# Altium project FMC_DIO_32ch_lvds_a.PrjPcb (part 1 of 2)
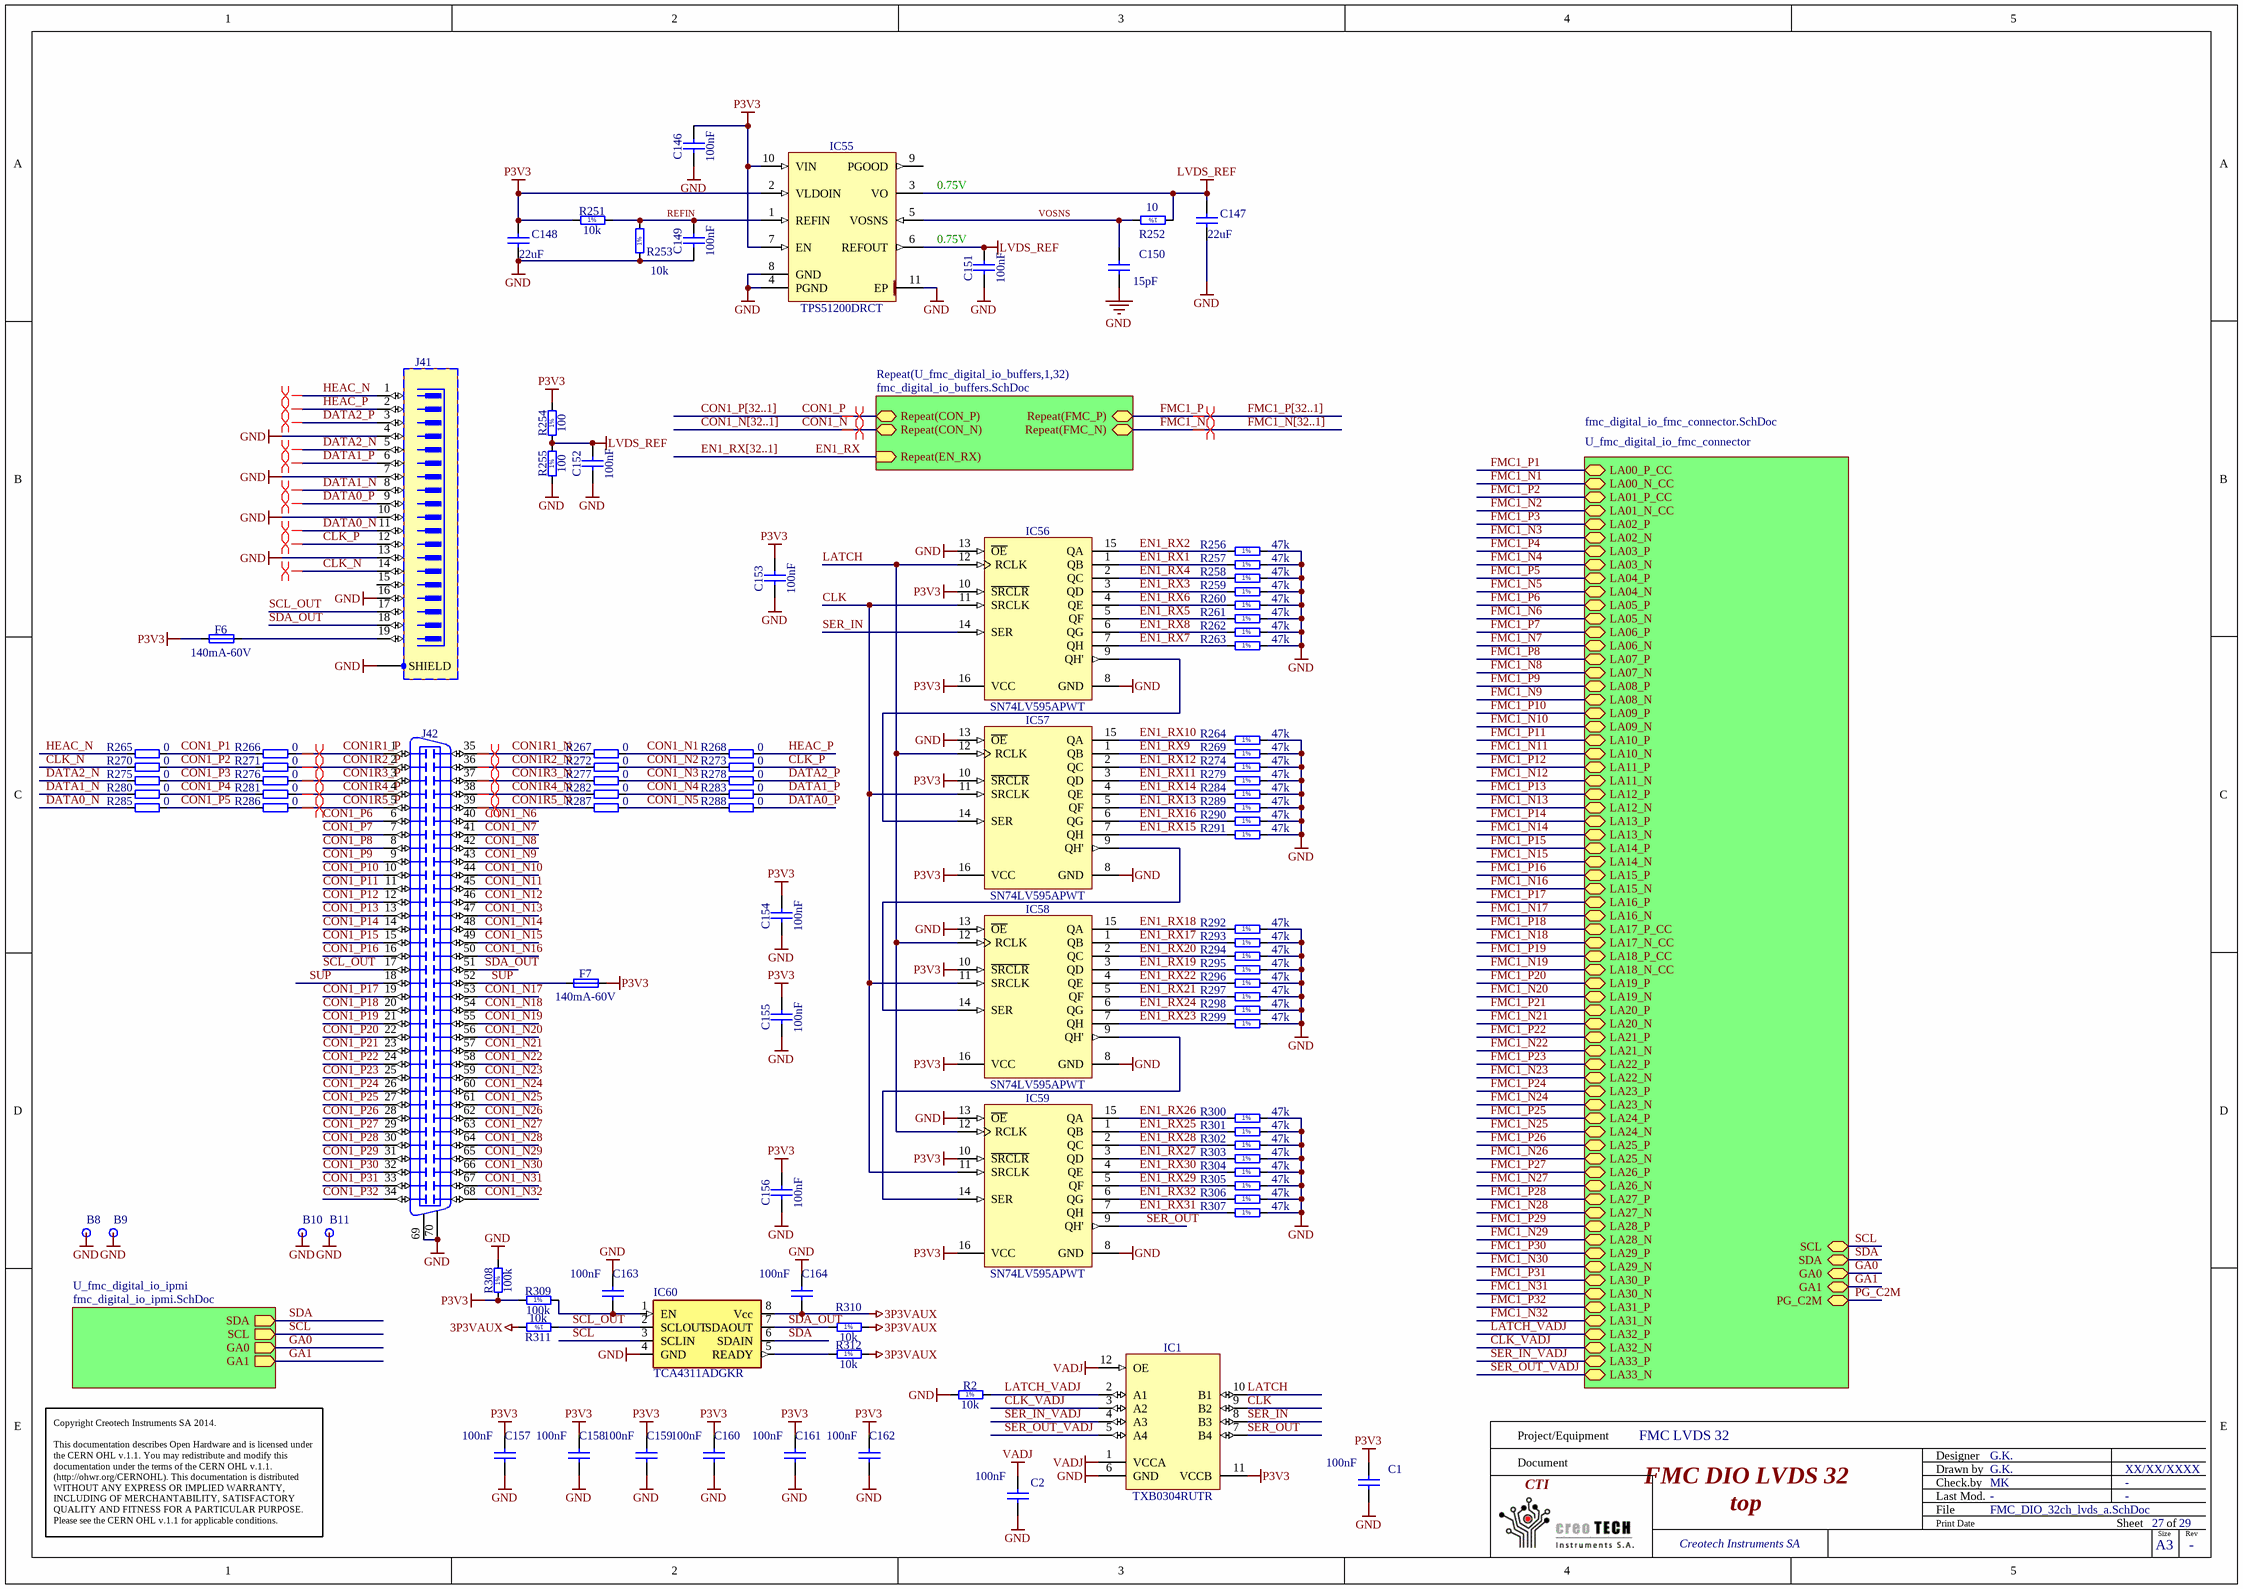
[diagram p0: FMC_DIO_32ch_lvds_a.SchDoc]
4 sheets, 558 parts. Net scope: hierarchical (ports join the sheet entries above them; power ports are global).
Board file: FMC_DIO_32ch_lvds_a.PcbDoc
Sheets:
  FMC_DIO_32ch_lvds_a.SchDoc
    U_fmc_digital_io_ipmi = fmc_digital_io_ipmi.SchDoc
    U_fmc_digital_io_fmc_connector = fmc_digital_io_fmc_connector.SchDoc
    U_fmc_digital_io_buffers1 = fmc_digital_io_buffers.SchDoc
    U_fmc_digital_io_buffers2 = fmc_digital_io_buffers.SchDoc
    U_fmc_digital_io_buffers3 = fmc_digital_io_buffers.SchDoc
    U_fmc_digital_io_buffers4 = fmc_digital_io_buffers.SchDoc
    U_fmc_digital_io_buffers5 = fmc_digital_io_buffers.SchDoc
    U_fmc_digital_io_buffers6 = fmc_digital_io_buffers.SchDoc
    U_fmc_digital_io_buffers7 = fmc_digital_io_buffers.SchDoc
    U_fmc_digital_io_buffers8 = fmc_digital_io_buffers.SchDoc
    U_fmc_digital_io_buffers9 = fmc_digital_io_buffers.SchDoc
    U_fmc_digital_io_buffers10 = fmc_digital_io_buffers.SchDoc
    U_fmc_digital_io_buffers11 = fmc_digital_io_buffers.SchDoc
    U_fmc_digital_io_buffers12 = fmc_digital_io_buffers.SchDoc
    U_fmc_digital_io_buffers13 = fmc_digital_io_buffers.SchDoc
    U_fmc_digital_io_buffers14 = fmc_digital_io_buffers.SchDoc
    U_fmc_digital_io_buffers15 = fmc_digital_io_buffers.SchDoc
    U_fmc_digital_io_buffers16 = fmc_digital_io_buffers.SchDoc
    U_fmc_digital_io_buffers17 = fmc_digital_io_buffers.SchDoc
    U_fmc_digital_io_buffers18 = fmc_digital_io_buffers.SchDoc
    U_fmc_digital_io_buffers19 = fmc_digital_io_buffers.SchDoc
    U_fmc_digital_io_buffers20 = fmc_digital_io_buffers.SchDoc
    U_fmc_digital_io_buffers21 = fmc_digital_io_buffers.SchDoc
    U_fmc_digital_io_buffers22 = fmc_digital_io_buffers.SchDoc
    U_fmc_digital_io_buffers23 = fmc_digital_io_buffers.SchDoc
    U_fmc_digital_io_buffers24 = fmc_digital_io_buffers.SchDoc
    U_fmc_digital_io_buffers25 = fmc_digital_io_buffers.SchDoc
    U_fmc_digital_io_buffers26 = fmc_digital_io_buffers.SchDoc
    U_fmc_digital_io_buffers27 = fmc_digital_io_buffers.SchDoc
    U_fmc_digital_io_buffers28 = fmc_digital_io_buffers.SchDoc
    U_fmc_digital_io_buffers29 = fmc_digital_io_buffers.SchDoc
    U_fmc_digital_io_buffers30 = fmc_digital_io_buffers.SchDoc
    U_fmc_digital_io_buffers31 = fmc_digital_io_buffers.SchDoc
    U_fmc_digital_io_buffers32 = fmc_digital_io_buffers.SchDoc

## Sheet FMC_DIO_32ch_lvds_a.SchDoc: FMC DIO LVDS 32
size 420 x 297 mm; Projet: FMC LVDS 32; CheckedBy: MK; Author: G.K.; CompanyName: CREOTECH; DrawnBy: G.K.; Organization: CTI SA; Address1: Creotech Instruments SA; Address2: Okulickiego 7/9, 05-500 Poland; DocumentNumber: 27; Revision: -; SheetNumber: 27; SheetTotal: 29; ModifiedBy: -; CreateDate: XX/XX/XXXX; CheckedDate: -; Title2: top; DivGrp: CTI; Designer: G.K.; ModifiedDate: -; ProjectName: FMC LVDS 32

### Parts
B8  Plated Hole  [MTG300_600]  (value not drawn)
B9  Plated Hole  [MTG300_600]  (value not drawn)
B10  Plated Hole  [MTG300_600]  (value not drawn)
B11  Plated Hole  [MTG300_600]  (value not drawn)
C1  100nF  [CAPC1005X55N]
C2  100nF  [CAPC1005X55N]
C146  100nF  [CAPC1005X55N]
C147  22uF  [CAPC3216X180N]
C148  22uF  [CAPC3216X180N]
C149  100nF  [CAPC1005X55N]
C150  15pF  [CAPC1005X55N]
C151  100nF  [CAPC1005X55N]
C152  100nF  [CAPC1005X55N]
C153  100nF  [CAPC1005X55N]
C154  100nF  [CAPC1005X55N]
C155  100nF  [CAPC1005X55N]
C156  100nF  [CAPC1005X55N]
C157  100nF  [CAPC1005X55N]
C158  100nF  [CAPC1005X55N]
C159  100nF  [CAPC1005X55N]
C160  100nF  [CAPC1005X55N]
C161  100nF  [CAPC1005X55N]
C162  100nF  [CAPC1005X55N]
C163  100nF  [CAPC1005X55N]
C164  100nF  [CAPC1005X55N]
F6  140mA-60V  [FUSRC4632X90N]
F7  140mA-60V  [FUSRC4632X90N]
IC1  TXB0304RUTR  [TEXAS_RUT (R-PUQFN-N12)]
IC55  TPS51200DRCT  [TEXAS_DRC (S-PVSON-N10)]
IC56  SN74LV595APWT  [SOP65P640X120-16N]
IC57  SN74LV595APWT  [SOP65P640X120-16N]
IC58  SN74LV595APWT  [SOP65P640X120-16N]
IC59  SN74LV595APWT  [SOP65P640X120-16N]
IC60  TCA4311ADGKR  [msop-8]
J41  HDMI  [MOLEX_46765-1001]  (value not drawn)
J42  DNP  [MOLEX_71430-0013]  (value not drawn)
R2  10k  [RESC1005X40N]
R251  10k  [RESC1005X40N]
R252  10  [RESC1005X40N]
R253  10k  [RESC1005X40N]
R254  100  [RESC1005X40N]
R255  100  [RESC1005X40N]
R256  47k  [RESC1005X40N]
R257  47k  [RESC1005X40N]
R258  47k  [RESC1005X40N]
R259  47k  [RESC1005X40N]
R260  47k  [RESC1005X40N]
R261  47k  [RESC1005X40N]
R262  47k  [RESC1005X40N]
R263  47k  [RESC1005X40N]
R264  47k  [RESC1005X40N]
R265  0  [RESC1005X40N]
R266  0  [RESC1005X40N]
R267  0  [RESC1005X40N]
R268  0  [RESC1005X40N]
R269  47k  [RESC1005X40N]
R270  0  [RESC1005X40N]
R271  0  [RESC1005X40N]
R272  0  [RESC1005X40N]
R273  0  [RESC1005X40N]
R274  47k  [RESC1005X40N]
R275  0  [RESC1005X40N]
R276  0  [RESC1005X40N]
R277  0  [RESC1005X40N]
R278  0  [RESC1005X40N]
R279  47k  [RESC1005X40N]
R280  0  [RESC1005X40N]
R281  0  [RESC1005X40N]
R282  0  [RESC1005X40N]
R283  0  [RESC1005X40N]
R284  47k  [RESC1005X40N]
R285  0  [RESC1005X40N]
R286  0  [RESC1005X40N]
R287  0  [RESC1005X40N]
R288  0  [RESC1005X40N]
R289  47k  [RESC1005X40N]
R290  47k  [RESC1005X40N]
R291  47k  [RESC1005X40N]
R292  47k  [RESC1005X40N]
R293  47k  [RESC1005X40N]
R294  47k  [RESC1005X40N]
R295  47k  [RESC1005X40N]
R296  47k  [RESC1005X40N]
R297  47k  [RESC1005X40N]
R298  47k  [RESC1005X40N]
R299  47k  [RESC1005X40N]
R300  47k  [RESC1005X40N]
R301  47k  [RESC1005X40N]
R302  47k  [RESC1005X40N]
R303  47k  [RESC1005X40N]
R304  47k  [RESC1005X40N]
R305  47k  [RESC1005X40N]
R306  47k  [RESC1005X40N]
R307  47k  [RESC1005X40N]
R308  100k  [RESC1005X40N]
R309  100k  [RESC1005X40N]
R310  10k  [RESC1005X40N]
R311  10k  [RESC1005X40N]
R312  10k  [RESC1005X40N]

### Sub-sheets
Repeat(U_fmc_digital_io_buffers,1,32) = fmc_digital_io_buffers.SchDoc: Repeat(EN_RX) (in), Repeat(CON_P) (bidir), Repeat(CON_N) (bidir), Repeat(FMC_P) (bidir), Repeat(FMC_N) (bidir)
U_fmc_digital_io_fmc_connector = fmc_digital_io_fmc_connector.SchDoc: LA26_P (bidir), LA25_P (bidir), LA33_P (bidir), LA33_N (bidir), LA32_P (bidir), LA32_N (bidir), LA00_P_CC (bidir), LA00_N_CC (bidir), LA01_P_CC (bidir), LA01_N_CC (bidir), LA02_P (bidir), LA02_N (bidir), LA03_P (bidir), LA03_N (bidir), LA04_P (bidir), LA04_N (bidir), LA05_P (bidir), LA05_N (bidir), LA06_P (bidir), LA06_N (bidir), LA08_P (bidir), LA07_P (bidir), LA08_N (bidir), LA07_N (bidir), LA09_P (bidir), LA09_N (bidir), LA10_P (bidir), LA10_N (bidir), LA12_P (bidir), LA11_P (bidir), LA12_N (bidir), LA11_N (bidir), LA13_P (bidir), LA13_N (bidir), LA14_P (bidir), LA14_N (bidir), LA15_P (bidir), LA15_N (bidir), LA16_P (bidir), LA16_N (bidir), LA17_P_CC (bidir), LA17_N_CC (bidir), LA18_P_CC (bidir), LA18_N_CC (bidir), LA19_P (bidir), LA19_N (bidir), LA20_P (bidir), LA20_N (bidir), LA23_P (bidir), LA22_P (bidir), LA23_N (bidir), LA21_P (bidir), LA22_N (bidir), LA21_N (bidir), LA24_P (bidir), LA24_N (bidir), LA26_N (bidir), LA25_N (bidir), LA27_P (bidir), LA27_N (bidir), SCL (bidir), SDA (bidir), GA0 (bidir), GA1 (bidir), PG_C2M (bidir), LA28_P (bidir), LA28_N (bidir), LA29_P (bidir), LA29_N (bidir), LA30_P (bidir), LA30_N (bidir), LA31_P (bidir), LA31_N (bidir)
U_fmc_digital_io_ipmi = fmc_digital_io_ipmi.SchDoc: SDA (out), SCL (out), GA0 (out), GA1 (out)

### Nets
3P3VAUX: C164.2 IC60.8(Vcc) R310.2 R311.2 R312.2
GND: B8.1 B9.1 B10.1 B11.1 C1.2 C2.2 C146.1 C147.1 C148.1 C149.1 C150.2 C151.1 C152.1 C153.1 C154.1 C155.1 C156.1 C157.2 C158.2 C159.2 C160.2 C161.2 C162.2 C163.1 C164.1 IC1.6(GND) IC55.4(PGND) IC55.8(GND) IC55.11(EP) IC56.8(GND) IC56.13(~{OE}) IC57.8(GND) IC57.13(~{OE}) IC58.8(GND) IC58.13(~{OE}) IC59.8(GND) IC59.13(~{OE}) IC60.4(GND) J41.4 J41.7 J41.10 J41.13 J41.16 J41.SHIELD J42.69 J42.70 R2.1 R253.1 R255.1 R256.2 R257.2 R258.2 R259.2 R260.2 R261.2 R262.2 R263.2 R264.2 R269.2 R274.2 R279.2 R284.2 R289.2 R290.2 R291.2 R292.2 R293.2 R294.2 R295.2 R296.2 R297.2 R298.2 R299.2 R300.2 R301.2 R302.2 R303.2 R304.2 R305.2 R306.2 R307.2 R308.2
LVDS_REF: C147.2 C151.2 C152.2 IC55.3(VO) IC55.6(REFOUT) R252.1 R254.1 R255.2
P3V3: C1.1 C146.2 C148.2 C153.2 C154.2 C155.2 C156.2 C157.1 C158.1 C159.1 C160.1 C161.1 C162.1 F6.1 F7.2 IC1.11(VCCB) IC55.2(VLDOIN) IC55.7(EN) IC55.10(VIN) IC56.10(~{SRCLR}) IC56.16(VCC) IC57.10(~{SRCLR}) IC57.16(VCC) IC58.10(~{SRCLR}) IC58.16(VCC) IC59.10(~{SRCLR}) IC59.16(VCC) R251.1 R254.2 R308.1 R309.1
VADJ: C2.1 IC1.1(VCCA) IC1.12(OE)
CLK: IC1.9(B2) IC56.11(SRCLK) IC57.11(SRCLK) IC58.11(SRCLK) IC59.11(SRCLK)
CLK_N: J41.14 R270.1
CLK_P: J41.12 R273.2
CLK_VADJ: IC1.3(A2) ; sheet U_fmc_digital_io_fmc_connector/LA32_N
CON1_N: sheet Repeat(U_fmc_digital_io_buffers,1,32)/Repeat(CON_N)
CON1_N1: R267.2 R268.1
CON1_N2: R272.2 R273.1
CON1_N3: R277.2 R278.1
CON1_N4: R282.2 R283.1
CON1_N5: R287.2 R288.1
CON1_N6: J42.40
CON1_N7: J42.41
CON1_N8: J42.42
CON1_N9: J42.43
CON1_N10: J42.44
CON1_N11: J42.45
CON1_N12: J42.46
CON1_N13: J42.47
CON1_N14: J42.48
CON1_N15: J42.49
CON1_N16: J42.50
CON1_N17: J42.53
CON1_N18: J42.54
CON1_N19: J42.55
CON1_N20: J42.56
CON1_N21: J42.57
CON1_N22: J42.58
CON1_N23: J42.59
CON1_N24: J42.60
CON1_N25: J42.61
CON1_N26: J42.62
CON1_N27: J42.63
CON1_N28: J42.64
CON1_N29: J42.65
CON1_N30: J42.66
CON1_N31: J42.67
CON1_N32: J42.68
CON1_P: sheet Repeat(U_fmc_digital_io_buffers,1,32)/Repeat(CON_P)
CON1_P1: R265.2 R266.1
CON1_P2: R270.2 R271.1
CON1_P3: R275.2 R276.1
CON1_P4: R280.2 R281.1
CON1_P5: R285.2 R286.1
CON1_P6: J42.6
CON1_P7: J42.7
CON1_P8: J42.8
CON1_P9: J42.9
CON1_P10: J42.10
CON1_P11: J42.11
CON1_P12: J42.12
CON1_P13: J42.13
CON1_P14: J42.14
CON1_P15: J42.15
CON1_P16: J42.16
CON1_P17: J42.19
CON1_P18: J42.20
CON1_P19: J42.21
CON1_P20: J42.22
CON1_P21: J42.23
CON1_P22: J42.24
CON1_P23: J42.25
CON1_P24: J42.26
CON1_P25: J42.27
CON1_P26: J42.28
CON1_P27: J42.29
CON1_P28: J42.30
CON1_P29: J42.31
CON1_P30: J42.32
CON1_P31: J42.33
CON1_P32: J42.34
CON1R1_N: J42.35 R267.1
CON1R1_P: J42.1 R266.2
CON1R2_N: J42.36 R272.1
CON1R2_P: J42.2 R271.2
CON1R3_N: J42.37 R277.1
CON1R3_P: J42.3 R276.2
CON1R4_N: J42.38 R282.1
CON1R4_P: J42.4 R281.2
CON1R5_N: J42.39 R287.1
CON1R5_P: J42.5 R286.2
DATA0_N: J41.11 R285.1
DATA0_P: J41.9 R288.2
DATA1_N: J41.8 R280.1
DATA1_P: J41.6 R283.2
DATA2_N: J41.5 R275.1
DATA2_P: J41.3 R278.2
EN1_RX: sheet Repeat(U_fmc_digital_io_buffers,1,32)/Repeat(EN_RX)
EN1_RX1: IC56.1(QB) R257.1
EN1_RX2: IC56.15(QA) R256.1
EN1_RX3: IC56.3(QD) R259.1
EN1_RX4: IC56.2(QC) R258.1
EN1_RX5: IC56.5(QF) R261.1
EN1_RX6: IC56.4(QE) R260.1
EN1_RX7: IC56.7(QH) R263.1
EN1_RX8: IC56.6(QG) R262.1
EN1_RX9: IC57.1(QB) R269.1
EN1_RX10: IC57.15(QA) R264.1
EN1_RX11: IC57.3(QD) R279.1
EN1_RX12: IC57.2(QC) R274.1
EN1_RX13: IC57.5(QF) R289.1
EN1_RX14: IC57.4(QE) R284.1
EN1_RX15: IC57.7(QH) R291.1
EN1_RX16: IC57.6(QG) R290.1
EN1_RX17: IC58.1(QB) R293.1
EN1_RX18: IC58.15(QA) R292.1
EN1_RX19: IC58.3(QD) R295.1
EN1_RX20: IC58.2(QC) R294.1
EN1_RX21: IC58.5(QF) R297.1
EN1_RX22: IC58.4(QE) R296.1
EN1_RX23: IC58.7(QH) R299.1
EN1_RX24: IC58.6(QG) R298.1
EN1_RX25: IC59.1(QB) R301.1
EN1_RX26: IC59.15(QA) R300.1
EN1_RX27: IC59.3(QD) R303.1
EN1_RX28: IC59.2(QC) R302.1
EN1_RX29: IC59.5(QF) R305.1
EN1_RX30: IC59.4(QE) R304.1
EN1_RX31: IC59.7(QH) R307.1
EN1_RX32: IC59.6(QG) R306.1
FMC1_N: sheet Repeat(U_fmc_digital_io_buffers,1,32)/Repeat(FMC_N)
FMC1_P: sheet Repeat(U_fmc_digital_io_buffers,1,32)/Repeat(FMC_P)
GA0: sheet U_fmc_digital_io_ipmi/GA0, sheet U_fmc_digital_io_fmc_connector/GA0
GA1: sheet U_fmc_digital_io_ipmi/GA1, sheet U_fmc_digital_io_fmc_connector/GA1
HEAC_N: J41.1 R265.1
HEAC_P: J41.2 R268.2
LATCH: IC1.10(B1) IC56.12(RCLK) IC57.12(RCLK) IC58.12(RCLK) IC59.12(RCLK)
LATCH_VADJ: IC1.2(A1) R2.2 ; sheet U_fmc_digital_io_fmc_connector/LA32_P  [project net LA32_P]
REFIN: C149.2 IC55.1(REFIN) R251.2 R253.2
SCL: IC60.3(SCLIN) ; sheet U_fmc_digital_io_ipmi/SCL, sheet U_fmc_digital_io_fmc_connector/SCL
SCL_OUT: IC60.2(SCLOUT) J41.17 J42.17 R311.1
SDA: IC60.6(SDAIN) ; sheet U_fmc_digital_io_ipmi/SDA, sheet U_fmc_digital_io_fmc_connector/SDA
SDA_OUT: IC60.7(SDAOUT) J41.18 J42.51 R310.1
SER_IN: IC1.8(B3) IC56.14(SER)
SER_IN_VADJ: IC1.4(A3) ; sheet U_fmc_digital_io_fmc_connector/LA33_P  [project net LA33_P]
SER_OUT: IC1.7(B4) IC59.9(QH')
SER_OUT_VADJ: IC1.5(A4) ; sheet U_fmc_digital_io_fmc_connector/LA33_N  [project net LA33_N]
SUP: F7.1 J42.18 J42.52
VOSNS: C150.1 IC55.5(VOSNS) R252.2
NetC163_2: C163.2 IC60.1(EN) R309.2
NetF6_2: F6.2 J41.19
NetIC56_9: IC56.9(QH') IC57.14(SER)
NetIC57_9: IC57.9(QH') IC58.14(SER)
NetIC58_9: IC58.9(QH') IC59.14(SER)
NetIC60_5: IC60.5(READY) R312.1

Not connected (* = marked no-connect by the designer): IC55 9(PGOOD); J41 15

### Buses and harness runs
bus CON1_N[32..1]
bus CON1_P[32..1]
bus EN1_RX[32..1]
bus FMC1_N[32..1]
bus FMC1_P[32..1]

### Layout directives
differential pair: CLK_N, CLK_P, CON1_N, CON1_P, CON1R1_N, CON1R1_P, CON1R2_N, CON1R2_P, CON1R3_N, CON1R3_P, CON1R4_N, CON1R4_P, CON1R5_N, CON1R5_P, DATA0_N, DATA0_P, DATA1_N, DATA1_P, DATA2_N, DATA2_P, FMC1_N, FMC1_P, HEAC_N, HEAC_P

### Notes on the sheet
- (near IC55) 0.75V
- (near C151) 0.75V
- Project/Equipment
- Document
- Designer
- Drawn by
- Check.by
- Copyright Creotech Instruments SA 2014.
  This documentation describes Open Hardware and is licensed under the CERN OHL v.1.1. You may redistribute and modify this documentation under the terms of the CERN OHL v.1.1. (http://ohwr.org/CERNOHL). This documentation is distributed WITHOUT ANY EXPRESS OR IMPLIED WARRANTY, INCLUDING OF MERCHANTABILITY, SATISFACTORY QUALITY AND FITNESS FOR A PARTICULAR PURPOSE. Please see the CERN OHL v.1.1 for applicable conditions.
- File
- Last Mod.
- Print Date
- Sheet
- Size
- A3
- of
- Rev
- (in symbol R0402_10K_1%_0.0625W_100PPM) 1%
- (in symbol R0402_10R_1%_0.0625W_200PPM) 1%
- (in symbol R0402_47K_1%_0.0625W_100PPM) 1%
- (in symbol R0402_100K_1%_0.0625W_100PPM) 1%
- (in symbol R0402_100R_1%_0.0625W_100PPM) 1%

### Library data of the parts
B8-B11 = PLATED_HOLE3.0_PAD6.0: Single Terminal Socket; Part Description: Plated Through Hole: Hole Dia.=3.0mm Pad Dia.=6.0mm; Mounted: No; Table: Pads; Part Number: PLATED_HOLE3.0_PAD6.0; Component Kind: Standard (No BOM); Component Type: Standard (No BOM); Designator: Single Terminal Socket; Library Reference: Single Terminal Socket; Pin Count: 1; Family: Plated Hole; Socket: No; SMD: No; Status: None; ComponentHeight: 0mm; Author: CERN DEM JLC; CreateDate: 26.05.2008; LatestRevisionDate: 26.05.2008; PackageDescription: Plated Through Hole: Hole Dia.=3.0mm Pad Dia.=6.0mm
C1 C2 C157-C164 = CC0402_100NF_16V_10%_X7R: Non-polarised capacitor; Part Description: SMD Multilayer Chip Ceramic Capacitor; Manufacturer: GENERIC; Manufacturer1 Part Number: GRM155R71C104KA88D; Voltage: 16V; TC: X7R; Tolerance: ±10%; Table: Capacitors SMD; Part Number: CC0402_100NF_16V_10%_X7R; Component Kind: Standard; Component Type: Standard; Pin Count: 2; Value: 100nF; Status: Not Recommended; Manufacturer Part Number: CC0402_100NF_16V_10%_X7R; Case: 0402; Mounted: Yes; Socket: No; SMD: Yes; Manufacturer1 Example: MURATA; Manufacturer1 ComponentHeight: 0.55mm; HelpURL: \\cern.ch\dfs\Applications\Altium\Datasheets\CC0402_X7R_MURATA_GRM.pdf; Author: CERN DEM JLC; CreateDate: 2013-12-05; LatestRevisionDate: 2007-12-03
C146 C149 C151-C156 = CC0402_100NF_16V_10%_X5R: Non-polarised capacitor; Part Description: SMD Multilayer Chip Ceramic Capacitor; Manufacturer: GENERIC; Manufacturer1 Part Number: GRM155R61C104KA88D; Voltage: 16V; TC: X5R; Tolerance: ±10%; Table: Capacitors SMD; Part Number: CC0402_100NF_16V_10%_X5R; Component Kind: Standard; Component Type: Standard; Pin Count: 2; Value: 100nF; Status: None; Manufacturer Part Number: CC0402_100NF_16V_10%_X5R; Case: 0402; Mounted: Yes; Socket: No; SMD: Yes; Manufacturer1 Example: MURATA; Manufacturer1 ComponentHeight: 0.55mm; HelpURL: \\cern.ch\dfs\Applications\Altium\Datasheets\CC0402_X5R_MURATA_GRM.pdf; Author: CERN DEM JLC; CreateDate: 2013-12-10; LatestRevisionDate: 2013-12-10
C147 C148 = CC1206_22UF_10V_10%_X7R: Non-polarised capacitor; Part Description: SMD Multilayer Chip Ceramic Capacitor; Manufacturer: GENERIC; Manufacturer1 Part Number: GRM31CR71A226KE15L; Voltage: 10V; TC: X7R; Tolerance: ±10%; Table: Capacitors SMD; Part Number: CC1206_22UF_10V_10%_X7R; Component Kind: Standard; Component Type: Standard; Pin Count: 2; Value: 22uF; Status: Preferred; Manufacturer Part Number: CC1206_22UF_10V_10%_X7R; Case: 1206; Mounted: Yes; Socket: No; SMD: Yes; Manufacturer1 Example: MURATA; Manufacturer1 ComponentHeight: 1.8mm; HelpURL: \\cern.ch\dfs\Applications\Altium\Datasheets\CC1206_X7R_MURATA_GRM-HI-CAP.pdf; Author: CERN DEM JLC; CreateDate: 2010-06-08; LatestRevisionDate: 2010-06-08
C150 = CC0402_15PF_50V_5%_NP0: Non-polarised capacitor; Part Description: SMD Multilayer Chip Ceramic Capacitor; Manufacturer: GENERIC; Manufacturer1 Part Number: 223886915159; Voltage: 50V; TC: NP0; Tolerance: ±5%; Table: Capacitors SMD; Part Number: CC0402_15PF_50V_5%_NP0; Component Kind: Standard; Component Type: Standard; Pin Count: 2; Value: 15pF; Status: Not Recommended; Manufacturer Part Number: CC0402_15PF_50V_5%_NP0; Case: 0402; Mounted: Yes; Socket: No; SMD: Yes; Manufacturer1 Example: PHYCOMP; Manufacturer1 ComponentHeight: 0.55mm; HelpURL: \\cern.ch\dfs\Applications\Altium\Datasheets\CC0402_NP0_PHYCOMP.pdf; Author: CERN DEM JLC; CreateDate: 2007-12-03; LatestRevisionDate: 2007-12-03
F6 F7 = FUSR1812_TYCO-MINISMDC014F: Fuse; Part Description: PolySwitch® PTC Overcurrent Protection Device; Manufacturer: TYCO ELECTRONICS; PressFit: No; Table: Fuses; Part Number: FUSR1812_TYCO-MINISMDC014F; Component Kind: Standard; Component Type: Standard; Pin Count: 2; PackageDescription: Chip Resettable Fuse, 2-Leads, Body 4.6x3.2mm, IPC Medium Density; Family: Fuses Resettable; Mounted: Yes; Socket: No; SMD: Yes; Value: 140mA-60V; Manufacturer Part Number: miniSMDC014F; ComponentHeight: 0.89mm; HelpURL: \\cern.ch\dfs\Applications\Altium\Datasheets\FUSR_TYCO_MiniSMDC014F.pdf; Author: CERN DEM JLC; CreateDate: 2008-07-02; LatestRevisionDate: 2012-10-10
IC1 = TXB0304RUTR: 4-bit Bidirectional Auto-direction Sensing Translator with Fully Symmetric 0.9V to 3.6V Range; Manufacturer: TEXAS INSTRUMENTS; PressFit: No; Bonding: No; Part Number: TXB0304RUTR; Component Kind: Standard; Component Type: Standard; Device: TXB0304RUTR; PackageDescription: SON, TEXAS RUT (R-PUQFN-N12), 0.50mm Pitch, 12-pin, 1.70mm W  X 2.00mm L X 0.55mm Height; Part Description: 4-bit Bidirectional Auto-direction Sensing Translator with Fully Symmetric 0.9V to 3.6V Range; Manufacturer Part Number: TXB0304RUTR; Pin Count: 12; Case: QFN12; Mounted: Yes; Socket: No; SMD: Yes; Sense: No; ComponentHeight: 0.55mm; Author: CERN DEM JLC; HelpURL: \\cern.ch\dfs\Applications\Altium\Datasheets\TXB0304RUTR.pdf; CreateDate: 27.10.2014; LatestRevisionDate: 28.10.2014
IC55 = TPS51200DRCT: Sink/Source DDR Termination Regulator; Part Description: 3.3V Sink/Source DDR Termination Regulator; Manufacturer: TEXAS INSTRUMENTS; PressFit: No; Bonding: No; Table: Regulators; Part Number: TPS51200DRCT; Component Kind: Standard; Component Type: Standard; Device: TPS51200DRCT; PackageDescription: SON, 0.50mm Pitch, 10-pin, 3.00mm W  X 3.00mm L X 1.00mm Height, (w/thermal tab 1.75 X 2.50 mm); Manufacturer Part Number: TPS51200DRCT; Pin Count: 11; Case: SON10; Mounted: Yes; Socket: No; SMD: Yes; ComponentHeight: 1mm; HelpURL: \\cern.ch\dfs\Applications\Altium\Datasheets\TPS51200DRCT.pdf; Author: CERN DEM JLC; CreateDate: 2010-02-03; LatestRevisionDate: 2013-11-06
IC56-IC59 = SN74LV595APWT: 8-Bit Shift Register With 3-State Output Register; Manufacturer: TEXAS INSTRUMENTS; PressFit: No; Bonding: No; Table: Standard Logic; Part Number: SN74LV595APWT; Component Kind: Standard; Component Type: Standard; Device: SN74LV595APWT; PackageDescription: SOP, 0.65mm pitch; 16 pin, 4.40mm W X 5.00mm L X 1.20mm H body IPC Medium Density; Part Description: 8-Bit Shift Register With 3-State Output Register; Manufacturer Part Number: SN74LV595APWT; Pin Count: 16; Case: TSSOP16; Mounted: Yes; Socket: No; SMD: Yes; ComponentHeight: 1.2mm; Author: CERN DEM JLC; HelpURL: \\cern.ch\dfs\Applications\Altium\Datasheets\SN74LV595APWT.pdf; CreateDate: 2012-05-10; LatestRevisionDate: 2012-05-10
IC60 = IIC_TCA4311A: HOT SWAPPABLE 2-WIRE BUS BUFFERS
J41 = MOLEX_46765-1001: Connector HDMI 19 Male + 1 Shield; Part Description: 0.4mm Pitch, Surface Mount Right Angle 19 Contacts Micro HDMI Type-D Receptacle With Kapton Tape  And Thru Hole Mounting Pads; Manufacturer: MOLEX; Mounted: No; PressFit: No; Part Number: MOLEX_46765-1001; Component Kind: Standard; Component Type: Standard; Pin Count: 20; Family: HDMI; Socket: No; SMD: Yes; Status: None; Manufacturer Part Number: 46765-1001; ComponentHeight: 2.9mm; HelpURL: \\cern.ch\dfs\Applications\Altium\Datasheets\MOLEX_46765-1001.pdf; Author: CERN DEM JLC; CreateDate: 2011-09-26; LatestRevisionDate: 2011-09-26; Table: MOLEX
J42 = MOLEX_71430-0013: Very High Density Cable Interconnect (VHDCI ) 68 Female; Part Description: 68 Positions, Pitch 0.8mm, Very Hight Density Right Angle Receptacle, VHDCI Standard (Recommended PCB Thickness: 1.6mm); Manufacturer: MOLEX; PressFit: No; Part Number: MOLEX_71430-0013; Component Kind: Standard; Component Type: Standard; Pin Count: 70; Family: VHDCI; Mounted: Yes; Socket: No; SMD: No; Status: None; Manufacturer Part Number: 71430-0013; ComponentHeight: 6.28mm; HelpURL: \\cern.ch\dfs\Applications\Altium\Datasheets\MOLEX_71430-0013.pdf; Author: CERN DEM JLC; CreateDate: 2014-01-30; LatestRevisionDate: 2014-01-30; Table: MOLEX
R2 R251 R253 R310-R312 = R0402_10K_1%_0.0625W_100PPM: Resistor - 1%; Part Description: General Purpose Thick Film Chip Resistor; Manufacturer: GENERIC; Manufacturer1 Part Number: 232270671003L; TC: ±100ppm/°C; Table: Resistors SMD; Part Number: R0402_10K_1%_0.0625W_100PPM; Component Kind: Standard; Component Type: Standard; Pin Count: 2; Value: 10k; Status: Not recommended; Power: 0.0625W; Tolerance: ±1%; Manufacturer Part Number: R0402_10K_1%_0.0625W_100PPM; Case: 0402; Mounted: Yes; Socket: No; SMD: Yes; Manufacturer1 Example: YAGEO PHYCOMP; Manufacturer1 ComponentHeight: 0.4mm; HelpURL: \\cern.ch\dfs\Applications\Altium\Datasheets\R0402_Phycomp_RC0402.pdf; Author: CERN DEM JLC; CreateDate: 2007-12-03; LatestRevisionDate: 2012-10-17
R252 = R0402_10R_1%_0.0625W_200PPM: Resistor - 1%; Part Description: General Purpose Thick Film Chip Resistor; Manufacturer: GENERIC; Manufacturer1 Part Number: 232270671009L; TC: ±200ppm/°C; Table: Resistors SMD; Part Number: R0402_10R_1%_0.0625W_200PPM; Component Kind: Standard; Component Type: Standard; Pin Count: 2; Value: 10; Status: Not recommended; Power: 0.0625W; Tolerance: ±1%; Manufacturer Part Number: R0402_10R_1%_0.0625W_200PPM; Case: 0402; Mounted: Yes; Socket: No; SMD: Yes; Manufacturer1 Example: YAGEO PHYCOMP; Manufacturer1 ComponentHeight: 0.4mm; HelpURL: \\cern.ch\dfs\Applications\Altium\Datasheets\R0402_Phycomp_RC0402.pdf; Author: CERN DEM JLC; CreateDate: 2009-06-24; LatestRevisionDate: 2012-10-17
R254 R255 = R0402_100R_1%_0.0625W_100PPM: Resistor - 1%; Part Description: General Purpose Thick Film Chip Resistor; Manufacturer: GENERIC; Manufacturer1 Part Number: 232270671001L; TC: ±100ppm/°C; Table: Resistors SMD; Part Number: R0402_100R_1%_0.0625W_100PPM; Component Kind: Standard; Component Type: Standard; Pin Count: 2; Value: 100; Status: Not recommended; Power: 0.0625W; Tolerance: ±1%; Manufacturer Part Number: R0402_100R_1%_0.0625W_100PPM; Case: 0402; Mounted: Yes; Socket: No; SMD: Yes; Manufacturer1 Example: YAGEO PHYCOMP; Manufacturer1 ComponentHeight: 0.4mm; HelpURL: \\cern.ch\dfs\Applications\Altium\Datasheets\R0402_Phycomp_RC0402.pdf; Author: CERN DEM JLC; CreateDate: 2007-12-03; LatestRevisionDate: 2012-10-17
R256-R264 R269 R274 R279 R284 R289-R307 = R0402_47K_1%_0.0625W_100PPM: Resistor - 1%; Part Description: General Purpose Thick Film Chip Resistor; Manufacturer: GENERIC; Manufacturer1 Part Number: 232270675103L; TC: ±100ppm/°C; Table: Resistors SMD; Part Number: R0402_47K_1%_0.0625W_100PPM; Component Kind: Standard; Component Type: Standard; Pin Count: 2; Value: 47k; Status: Not recommended; Power: 0.0625W; Tolerance: ±1%; Manufacturer Part Number: R0402_47K_1%_0.0625W_100PPM; Case: 0402; Mounted: Yes; Socket: No; SMD: Yes; Manufacturer1 Example: YAGEO PHYCOMP; Manufacturer1 ComponentHeight: 0.4mm; HelpURL: \\cern.ch\dfs\Applications\Altium\Datasheets\R0402_Phycomp_RC0402.pdf; Author: CERN DEM JLC; CreateDate: 2007-12-03; LatestRevisionDate: 2012-10-17
R265-R268 R270-R273 R275-R278 R280-R283 R285-R288 = R0402_0R_JUMPER: Resistor; Part Description: 1A (0.05R Max DC Resistance) Zero Ohm Jumper; Manufacturer: GENERIC; Manufacturer1 Part Number: 232270591001L; Table: Resistors SMD; Part Number: R0402_0R_JUMPER; Component Kind: Standard; Component Type: Standard; Pin Count: 2; Value: 0; Status: Not recommended; Manufacturer Part Number: R0402_0R_JUMPER; Case: 0402; Mounted: Yes; Socket: No; SMD: Yes; Manufacturer1 Example: YAGEO PHYCOMP; Manufacturer1 ComponentHeight: 0.4mm; HelpURL: \\cern.ch\dfs\Applications\Altium\Datasheets\R0402_Phycomp_RC0402.pdf; Author: CERN DEM JLC; CreateDate: 2007-12-03; LatestRevisionDate: 2012-10-17
R308 R309 = R0402_100K_1%_0.0625W_100PPM: Resistor - 1%; Part Description: General Purpose Thick Film Chip Resistor; Manufacturer: GENERIC; Manufacturer1 Part Number: 232270671004L; TC: ±100ppm/°C; Table: Resistors SMD; Part Number: R0402_100K_1%_0.0625W_100PPM; Component Kind: Standard; Component Type: Standard; Pin Count: 2; Value: 100k; Status: Not recommended; Power: 0.0625W; Tolerance: ±1%; Manufacturer Part Number: R0402_100K_1%_0.0625W_100PPM; Case: 0402; Mounted: Yes; Socket: No; SMD: Yes; Manufacturer1 Example: YAGEO PHYCOMP; Manufacturer1 ComponentHeight: 0.4mm; HelpURL: \\cern.ch\dfs\Applications\Altium\Datasheets\R0402_Phycomp_RC0402.pdf; Author: CERN DEM JLC; CreateDate: 2007-12-03; LatestRevisionDate: 2012-10-17

## Sheet fmc_digital_io_ipmi.SchDoc: EEPROM &
size 420 x 297 mm; EDA_Number: EDA-02064-V1-0; Projet: FmcDIO16chTTLa; CheckedBy: MK; Author: G.K.; CompanyName: CREOTECH; DrawnBy: G.K.; Organization: CTI SA; Address1: Creotech Instruments SA; Address2: Okulickiego 7/9, 05-500 Poland; DocumentNumber: 28; Revision: -; SheetNumber: 28; SheetTotal: 29; ModifiedBy: -; CreateDate: XX/XX/XXXX; CheckedDate: -; Title2: Thermometer; DivGrp: CTI; Designer: G.K.; ModifiedDate: -; ProjectName: FMC LVDS 32
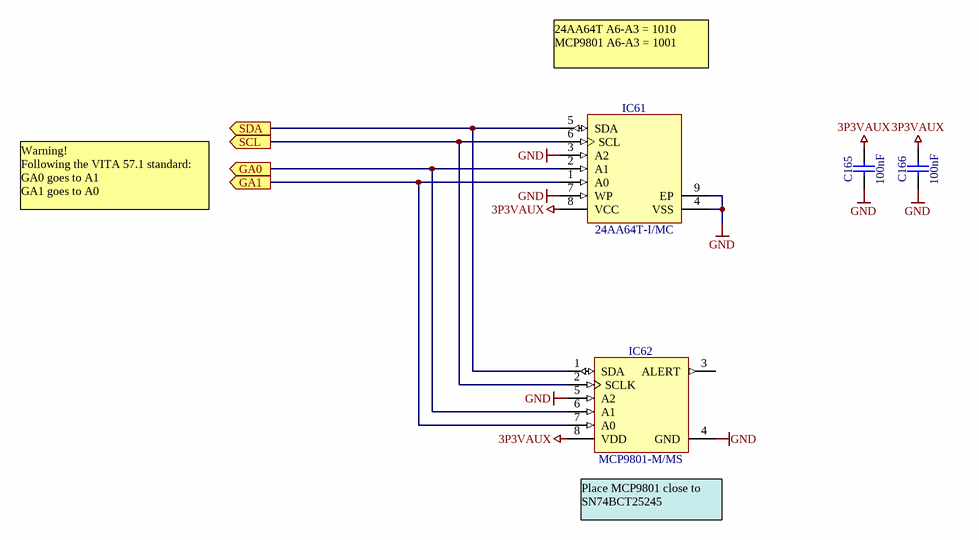
[diagram p1: fmc_digital_io_ipmi.SchDoc]

### Parts
C165  100nF  [CAPC1005X55N]
C166  100nF  [CAPC1005X55N]
IC61  24AA64T-I/MC  [SON50P300X200X100-9N-S175X155]
IC62  MCP9801-M/MS  [SOP65P490X110-8N]

### Ports
GA0 (out), GA1 (out), SCL (out), SDA (out)

### Nets
3P3VAUX: C165.2 C166.2 IC61.8(VCC) IC62.8(VDD)
GND: C165.1 C166.1 IC61.3(A2) IC61.4(VSS) IC61.7(WP) IC61.9(EP) IC62.4(GND) IC62.5(A2)
GA0: IC61.2(A1) IC62.6(A1) ; port GA0
GA1: IC61.1(A0) IC62.7(A0) ; port GA1
SCL: IC61.6(SCL) IC62.2(SCLK) ; port SCL
SDA: IC61.5(SDA) IC62.1(SDA) ; port SDA

Not connected (* = marked no-connect by the designer): IC62 3(ALERT)

### Notes on the sheet
- 24AA64T A6-A3 = 1010
  MCP9801 A6-A3 = 1001
- Warning!
  Following the VITA 57.1 standard:
  GA0 goes to A1
  GA1 goes to A0
- (near IC62) Place MCP9801 close to SN74BCT25245
- Project/Equipment
- Document
- Designer
- Drawn by
- Check.by
- Copyright Creotech Instruments SA 2014.
  This documentation describes Open Hardware and is licensed under the CERN OHL v.1.1. You may redistribute and modify this documentation under the terms of the CERN OHL v.1.1. (http://ohwr.org/CERNOHL). This documentation is distributed WITHOUT ANY EXPRESS OR IMPLIED WARRANTY, INCLUDING OF MERCHANTABILITY, SATISFACTORY QUALITY AND FITNESS FOR A PARTICULAR PURPOSE. Please see the CERN OHL v.1.1 for applicable conditions.
- File
- Last Mod.
- Print Date
- Sheet
- Size
- A3
- of
- Rev

### Library data of the parts
C165 C166 = CC0402_100NF_16V_10%_X5R: as C146 on sheet FMC_DIO_32ch_lvds_a; Part Number: CC0402_100NF_16V_10%_X5R; Component Kind: Standard; Component Type: Standard; Pin Count: 2; Value: 100nF; Status: None; Manufacturer Part Number: CC0402_100NF_16V_10%_X5R; Case: 0402; Mounted: Yes; Socket: No; SMD: Yes; Manufacturer1 Example: MURATA; Manufacturer1 ComponentHeight: 0.55mm; HelpURL: \\cern.ch\dfs\Applications\Altium\Datasheets\CC0402_X5R_MURATA_GRM.pdf; Author: CERN DEM JLC; CreateDate: 2013-12-10; LatestRevisionDate: 2013-12-10
IC61 = 24AA64T-I/MC: 1.7-5.5V 64K I2C Serial EEPROM; Manufacturer: MICROCHIP TECHNOLOGY; Table: Logic; Part Number: 24AA64T-I/MC; Component Kind: Standard; Component Type: Standard; Designator: 24AA64T-I/MC; Device: 24AA64T-I/MC; PackageDescription: SON (DFN), 0.50mm pitch, 8 pin, 2mm X 3mm X 1.00mm H body (w/thermal tab 1.75 X 1.55mm),  IPC Medium Density; Part Description: 64K I2C Serial EEPROM; Manufacturer Part Number: 24AA64T-I/MC; Pin Count: 9; Case: DFN8; Mounted: Yes; Socket: No; SMD: Yes; ComponentHeight: 1.0mm; Datasheet: \\cern.ch\dfs\Applications\Altium\Datasheets\24AA64T-I-MC.pdf; HelpURL: \\cern.ch\dfs\Applications\Altium\Datasheets\24AA64T-I-MC.pdf; Author: CERN DEM JLC; CreateDate: 11/18/2009; LatestRevisionDate: 11/18/2009
IC62 = MCP9801-M/MS: 2-Wire High-Accuracy Temperature Sensor; Manufacturer: MICROCHIP TECHNOLOGIY; Table: Sensors; Part Number: MCP9801-M/MS; Component Kind: Standard; Component Type: Standard; Designator: MCP9801-M/MS; Device: MCP9801-M/MS; PackageDescription: SOP, 0.65mm pitch; 8 pin, 3.00mm W X 3.00mm L X 1.10mm H body, IPC Medium Density; Part Description: 2-Wire High-Accuracy Temperature Sensor; Manufacturer Part Number: MCP9801-M/MS; Pin Count: 8; Case: MSOP8; Mounted: Yes; Socket: No; SMD: Yes; ComponentHeight: 1.1mm; Datasheet: \\cern.ch\dfs\Applications\Altium\Datasheets\MCP9801-M-MS.pdf; HelpURL: \\cern.ch\dfs\Applications\Altium\Datasheets\MCP9801-M-MS.pdf; Author: CERN DEM JLC; CreateDate: 11/18/2009; LatestRevisionDate: 11/18/2009

## Sheet fmc_digital_io_fmc_connector.SchDoc: FMC
size 420 x 297 mm; EDA_Number: EDA-02064-V1-0; Projet: FmcDIO16chTTLa; CheckedBy: MK; Author: G.K.; CompanyName: CREOTECH; DrawnBy: G.K.; Organization: CTI SA; Address1: Creotech Instruments SA; Address2: Okulickiego 7/9, 05-500 Poland; DocumentNumber: 26; Revision: -; SheetNumber: 26; SheetTotal: 29; ModifiedBy: -; CreateDate: XX/XX/XXXX; CheckedDate: -; Title2: connector; DivGrp: CTI; Designer: G.K.; ModifiedDate: -; ProjectName: FMC LVDS 32
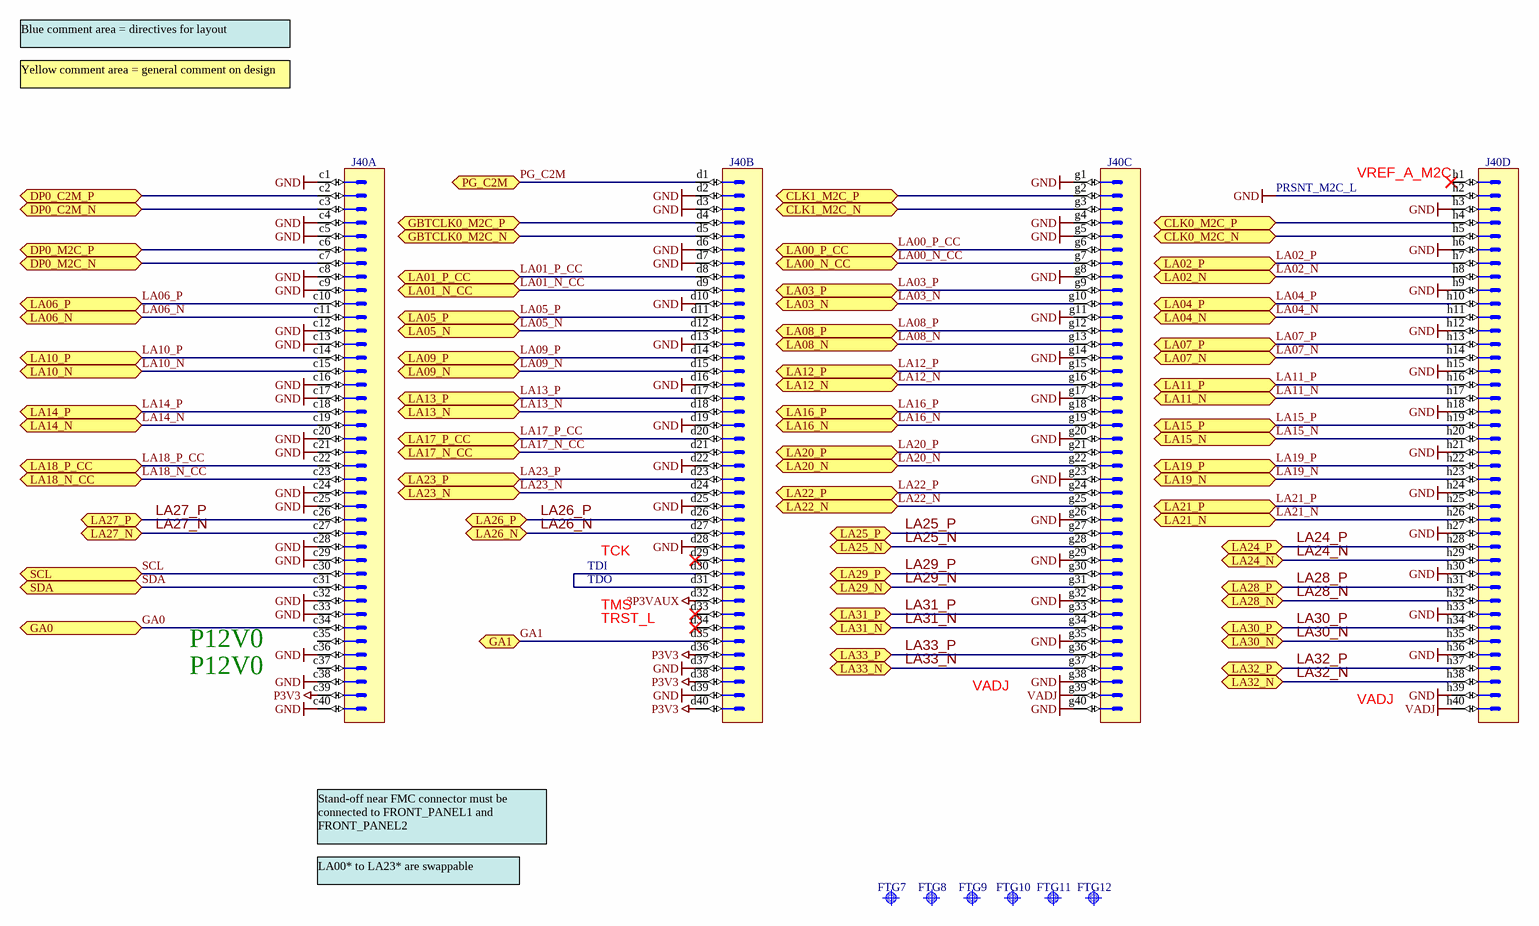
[diagram p2: fmc_digital_io_fmc_connector.SchDoc]

### Parts
FTG7  Use only in PCB  [FIDUCIAL_TOP_S100-200]  (value not drawn)
FTG8  Use only in PCB  [FIDUCIAL_TOP_S100-200]  (value not drawn)
FTG9  Use only in PCB  [FIDUCIAL_TOP_S100-200]  (value not drawn)
FTG10  Use only in PCB  [FIDUCIAL_TOP_S100-200]  (value not drawn)
FTG11  Use only in PCB  [FIDUCIAL_TOP_S100-200]  (value not drawn)
FTG12  Use only in PCB  [FIDUCIAL_TOP_S100-200]  (value not drawn)
J40  VITA 57  [SAMTEC_ASP-127797-01]  (value not drawn)  (parts A,B,C,D of 4)

### Ports
CLK0_M2C_N (bidir), CLK0_M2C_P (bidir), CLK1_M2C_N (bidir), CLK1_M2C_P (bidir), DP0_C2M_N (bidir), DP0_C2M_P (bidir), DP0_M2C_N (bidir), DP0_M2C_P (bidir), GA0 (bidir), GA1 (bidir), GBTCLK0_M2C_N (bidir), GBTCLK0_M2C_P (bidir), LA00_N_CC (bidir), LA00_P_CC (bidir), LA01_N_CC (bidir), LA01_P_CC (bidir), LA02_N (bidir), LA02_P (bidir), LA03_N (bidir), LA03_P (bidir), LA04_N (bidir), LA04_P (bidir), LA05_N (bidir), LA05_P (bidir), LA06_N (bidir), LA06_P (bidir), LA07_N (bidir), LA07_P (bidir), LA08_N (bidir), LA08_P (bidir), LA09_N (bidir), LA09_P (bidir), LA10_N (bidir), LA10_P (bidir), LA11_N (bidir), LA11_P (bidir), LA12_N (bidir), LA12_P (bidir), LA13_N (bidir), LA13_P (bidir), LA14_N (bidir), LA14_P (bidir), LA15_N (bidir), LA15_P (bidir), LA16_N (bidir), LA16_P (bidir), LA17_N_CC (bidir), LA17_P_CC (bidir), LA18_N_CC (bidir), LA18_P_CC (bidir), LA19_N (bidir), LA19_P (bidir), LA20_N (bidir), LA20_P (bidir), LA21_N (bidir), LA21_P (bidir), LA22_N (bidir), LA22_P (bidir), LA23_N (bidir), LA23_P (bidir), LA24_N (bidir), LA24_P (bidir), LA25_N (bidir), LA25_P (bidir), LA26_N (bidir), LA26_P (bidir), LA27_N (bidir), LA27_P (bidir), LA28_N (bidir), LA28_P (bidir), LA29_N (bidir), LA29_P (bidir), LA30_N (bidir), LA30_P (bidir), LA31_N (bidir), LA31_P (bidir), LA32_N (bidir), LA32_P (bidir), LA33_N (bidir), LA33_P (bidir), PG_C2M (bidir), SCL (bidir), SDA (bidir)

### Nets
3P3VAUX: J40.d32
GND: J40.c1 J40.c4 J40.c5 J40.c8 J40.c9 J40.c12 J40.c13 J40.c16 J40.c17 J40.c20 J40.c21 J40.c24 J40.c25 J40.c28 J40.c29 J40.c32 J40.c33 J40.c36 J40.c38 J40.c40 J40.d2 J40.d3 J40.d6 J40.d7 J40.d10 J40.d13 J40.d16 J40.d19 J40.d22 J40.d25 J40.d28 J40.d37 J40.d39 J40.g1 J40.g4 J40.g5 J40.g8 J40.g11 J40.g14 J40.g17 J40.g20 J40.g23 J40.g26 J40.g29 J40.g32 J40.g35 J40.g38 J40.g40 J40.h2 J40.h3 J40.h6 J40.h9 J40.h12 J40.h15 J40.h18 J40.h21 J40.h24 J40.h27 J40.h30 J40.h33 J40.h36 J40.h39
P3V3: J40.c39 J40.d36 J40.d38 J40.d40
VADJ: J40.g39 J40.h40
GA0: J40.c34 ; port GA0
GA1: J40.d35 ; port GA1
LA00_N_CC: J40.g7 ; port LA00_N_CC  [project net FMC1_N1]
LA00_P_CC: J40.g6 ; port LA00_P_CC  [project net FMC1_P1]
LA01_N_CC: J40.d9 ; port LA01_N_CC  [project net FMC1_N2]
LA01_P_CC: J40.d8 ; port LA01_P_CC  [project net FMC1_P2]
LA02_N: J40.h8 ; port LA02_N  [project net FMC1_N3]
LA02_P: J40.h7 ; port LA02_P  [project net FMC1_P3]
LA03_N: J40.g10 ; port LA03_N  [project net FMC1_N4]
LA03_P: J40.g9 ; port LA03_P  [project net FMC1_P4]
LA04_N: J40.h11 ; port LA04_N  [project net FMC1_N5]
LA04_P: J40.h10 ; port LA04_P  [project net FMC1_P5]
LA05_N: J40.d12 ; port LA05_N  [project net FMC1_N6]
LA05_P: J40.d11 ; port LA05_P  [project net FMC1_P6]
LA06_N: J40.c11 ; port LA06_N  [project net FMC1_N7]
LA06_P: J40.c10 ; port LA06_P  [project net FMC1_P7]
LA07_N: J40.h14 ; port LA07_N  [project net FMC1_N8]
LA07_P: J40.h13 ; port LA07_P  [project net FMC1_P8]
LA08_N: J40.g13 ; port LA08_N  [project net FMC1_N9]
LA08_P: J40.g12 ; port LA08_P  [project net FMC1_P9]
LA09_N: J40.d15 ; port LA09_N  [project net FMC1_N10]
LA09_P: J40.d14 ; port LA09_P  [project net FMC1_P10]
LA10_N: J40.c15 ; port LA10_N  [project net FMC1_N11]
LA10_P: J40.c14 ; port LA10_P  [project net FMC1_P11]
LA11_N: J40.h17 ; port LA11_N  [project net FMC1_N12]
LA11_P: J40.h16 ; port LA11_P  [project net FMC1_P12]
LA12_N: J40.g16 ; port LA12_N  [project net FMC1_N13]
LA12_P: J40.g15 ; port LA12_P  [project net FMC1_P13]
LA13_N: J40.d18 ; port LA13_N  [project net FMC1_N14]
LA13_P: J40.d17 ; port LA13_P  [project net FMC1_P14]
LA14_N: J40.c19 ; port LA14_N  [project net FMC1_N15]
LA14_P: J40.c18 ; port LA14_P  [project net FMC1_P15]
LA15_N: J40.h20 ; port LA15_N  [project net FMC1_N16]
LA15_P: J40.h19 ; port LA15_P  [project net FMC1_P16]
LA16_N: J40.g19 ; port LA16_N  [project net FMC1_N17]
LA16_P: J40.g18 ; port LA16_P  [project net FMC1_P17]
LA17_N_CC: J40.d21 ; port LA17_N_CC  [project net FMC1_N18]
LA17_P_CC: J40.d20 ; port LA17_P_CC  [project net FMC1_P18]
LA18_N_CC: J40.c23 ; port LA18_N_CC  [project net FMC1_N19]
LA18_P_CC: J40.c22 ; port LA18_P_CC  [project net FMC1_P19]
LA19_N: J40.h23 ; port LA19_N  [project net FMC1_N20]
LA19_P: J40.h22 ; port LA19_P  [project net FMC1_P20]
LA20_N: J40.g22 ; port LA20_N  [project net FMC1_N21]
LA20_P: J40.g21 ; port LA20_P  [project net FMC1_P21]
LA21_N: J40.h26 ; port LA21_N  [project net FMC1_N22]
LA21_P: J40.h25 ; port LA21_P  [project net FMC1_P22]
LA22_N: J40.g25 ; port LA22_N  [project net FMC1_N23]
LA22_P: J40.g24 ; port LA22_P  [project net FMC1_P23]
LA23_N: J40.d24 ; port LA23_N  [project net FMC1_N24]
LA23_P: J40.d23 ; port LA23_P  [project net FMC1_P24]
LA24_N: J40.h29 ; port LA24_N  [project net FMC1_N25]
LA24_P: J40.h28 ; port LA24_P  [project net FMC1_P25]
LA25_N: J40.g28 ; port LA25_N  [project net FMC1_N26]
LA25_P: J40.g27 ; port LA25_P  [project net FMC1_P26]
LA26_N: J40.d27 ; port LA26_N  [project net FMC1_N27]
LA26_P: J40.d26 ; port LA26_P  [project net FMC1_P27]
LA27_N: J40.c27 ; port LA27_N  [project net FMC1_N28]
LA27_P: J40.c26 ; port LA27_P  [project net FMC1_P28]
LA28_N: J40.h32 ; port LA28_N  [project net FMC1_N29]
LA28_P: J40.h31 ; port LA28_P  [project net FMC1_P29]
LA29_N: J40.g31 ; port LA29_N  [project net FMC1_N30]
LA29_P: J40.g30 ; port LA29_P  [project net FMC1_P30]
LA30_N: J40.h35 ; port LA30_N  [project net FMC1_N31]
LA30_P: J40.h34 ; port LA30_P  [project net FMC1_P31]
LA31_N: J40.g34 ; port LA31_N  [project net FMC1_N32]
LA31_P: J40.g33 ; port LA31_P  [project net FMC1_P32]
LA32_N: J40.h38 ; port LA32_N  [project net CLK_VADJ]
LA32_P: J40.h37 ; port LA32_P
LA33_N: J40.g37 ; port LA33_N
LA33_P: J40.g36 ; port LA33_P
PG_C2M: J40.d1 ; port PG_C2M
SCL: J40.c30 ; port SCL
SDA: J40.c31 ; port SDA
NetJ40_c2: J40.c2 ; port DP0_C2M_P
NetJ40_c3: J40.c3 ; port DP0_C2M_N
NetJ40_c6: J40.c6 ; port DP0_M2C_P
NetJ40_c7: J40.c7 ; port DP0_M2C_N
NetJ40_d4: J40.d4 ; port GBTCLK0_M2C_P
NetJ40_d5: J40.d5 ; port GBTCLK0_M2C_N
NetJ40_d30: J40.d30 J40.d31
NetJ40_g2: J40.g2 ; port CLK1_M2C_P
NetJ40_g3: J40.g3 ; port CLK1_M2C_N
NetJ40_h4: J40.h4 ; port CLK0_M2C_P
NetJ40_h5: J40.h5 ; port CLK0_M2C_N

Not connected (* = marked no-connect by the designer): J40 c35 c37 d29* d33* d34* h1*

### Notes on the sheet
- Blue comment area = directives for layout
- Yellow comment area = general comment on design
- (near J40) VREF_A_M2C
- PRSNT_M2C_L
- TDI
- TDO
- TCK
- P12V0
- TMS
- TRST_L
- VADJ
- Stand-off near FMC connector must be connected to FRONT_PANEL1 and FRONT_PANEL2
- LA00* to LA23* are swappable
- Project/Equipment
- Document
- Designer
- Drawn by
- Check.by
- Copyright Creotech Instruments SA 2014.
  This documentation describes Open Hardware and is licensed under the CERN OHL v.1.1. You may redistribute and modify this documentation under the terms of the CERN OHL v.1.1. (http://ohwr.org/CERNOHL). This documentation is distributed WITHOUT ANY EXPRESS OR IMPLIED WARRANTY, INCLUDING OF MERCHANTABILITY, SATISFACTORY QUALITY AND FITNESS FOR A PARTICULAR PURPOSE. Please see the CERN OHL v.1.1 for applicable conditions.
- File
- Last Mod.
- Print Date
- Sheet
- Size
- A3
- of
- Rev

### Library data of the parts
FTG7-FTG12 = FIDUCIAL_TARGET_S100-200: Fiducial Target; Part Description: Scare Fiducial Target, Top Layer, 1.0mm, Top Sloder 2.0mm, Keepout =2.0mm; Mounted: No; Table: Pads; Part Number: FIDUCIAL_TARGET_S100-200; Component Kind: Standard (No BOM); Component Type: Standard (No BOM); Pin Count: 1; Family: Fiducial; Socket: No; SMD: Yes; Status: None; ComponentHeight: 0mm; Author: CERN DEM JLC; CreateDate: 09.02.2010; LatestRevisionDate: 09.02.2010; PackageDescription: Scare Fiducial Target, Top Layer, 1.0mm, Top Sloder 2.0mm, Keepout =2.0mm
J40 = SAMTEC_ASP-127797-01: Connector VITA 57, 160 Male contacts in 4 row cdgh; Part Description: 160 contacts (4 rows cdgh) Surface Mount Male Connector, VITA 57; Manufacturer: SAMTEC; Manufacturer Part Number: ASP-134488-01; Part Number: SAMTEC_ASP-127797-01; Component Kind: Standard; Component Type: Standard; Designator: Connector VITA 57 160 Male (cdgh); Library Reference: Connector VITA 57 160 Male (cdgh); Pin Count: 160; Family: VITA 57; Mounted: Yes; Socket: No; SMD: Yes; Status: None; ComponentHeight: 6.1mm; Datasheet: \\cern.ch\dfs\Applications\Altium\Datasheets\SAMTEC_ASP-127797-01.pdf; HelpURL: \\cern.ch\dfs\Applications\Altium\Datasheets\SAMTEC_ASP-127797-01.pdf; Author: CERN DEM JLC; CreateDate: 9/24/2009; LatestRevisionDate: 9/24/2009; Table: SAMTEC

## Sheet fmc_digital_io_buffers.SchDoc: LVDS buffer
size 420 x 297 mm; EDA_Number: EDA-02064-V1-0; Projet: FmcDIO16chTTLa; CheckedBy: MK; Author: G.K.; CompanyName: CREOTECH; DrawnBy: G.K.; Organization: CTI SA; Address1: Creotech Instruments SA; Address2: Okulickiego 7/9, 05-500 Poland; DocumentNumber: 29; Revision: -; SheetNumber: 29; SheetTotal: 29; ModifiedBy: -; CreateDate: XX/XX/XXXX; CheckedDate: -; DivGrp: CTI; Designer: G.K.; ModifiedDate: -; ProjectName: FMC LVDS 32
Used 32 times, as channels U_fmc_digital_io_buffers1, U_fmc_digital_io_buffers2, U_fmc_digital_io_buffers3, U_fmc_digital_io_buffers4, U_fmc_digital_io_buffers5, U_fmc_digital_io_buffers6, U_fmc_digital_io_buffers7, U_fmc_digital_io_buffers8, U_fmc_digital_io_buffers9, U_fmc_digital_io_buffers10, U_fmc_digital_io_buffers11, U_fmc_digital_io_buffers12, U_fmc_digital_io_buffers13, U_fmc_digital_io_buffers14, U_fmc_digital_io_buffers15, U_fmc_digital_io_buffers16, U_fmc_digital_io_buffers17, U_fmc_digital_io_buffers18, U_fmc_digital_io_buffers19, U_fmc_digital_io_buffers20, U_fmc_digital_io_buffers21, U_fmc_digital_io_buffers22, U_fmc_digital_io_buffers23, U_fmc_digital_io_buffers24, U_fmc_digital_io_buffers25, U_fmc_digital_io_buffers26, U_fmc_digital_io_buffers27, U_fmc_digital_io_buffers28, U_fmc_digital_io_buffers29, U_fmc_digital_io_buffers30, U_fmc_digital_io_buffers31, U_fmc_digital_io_buffers32. Parts and nets are listed once, with the designators drawn on the sheet.
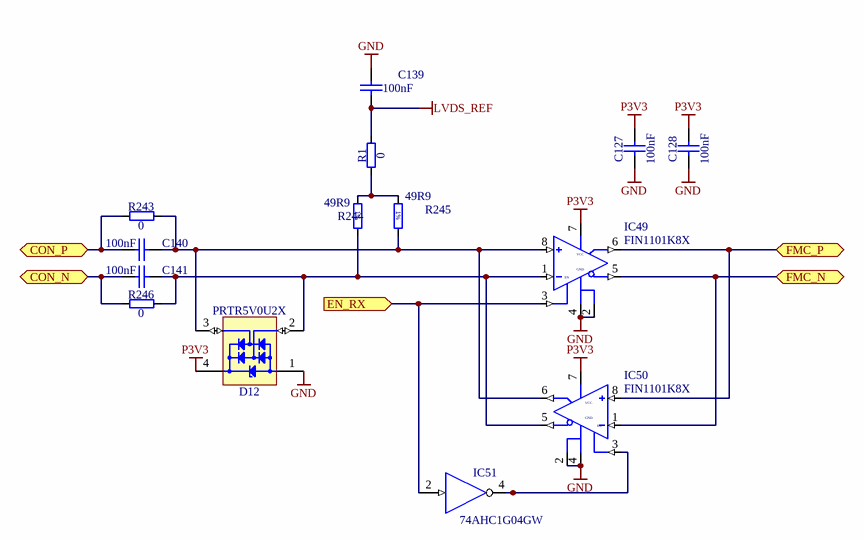
[diagram p3: fmc_digital_io_buffers.SchDoc]

### Parts
C127  100nF  [CAPC1005X55N]
C128  100nF  [CAPC1005X55N]
C139  100nF  [CAPC1005X55N]
C140  100nF  [CAPC1005X55N]
C141  100nF  [CAPC1005X55N]
D12  PRTR5V0U2X  [SOT190P230X110-4N]
IC49  FIN1101K8X  [US8]
IC50  FIN1101K8X  [US8]
IC51  74AHC1G04GW  [SOT65P212X110-5N]
R1  0  [RESC1005X40N]
R243  0  [RESC1005X40N]
R244  49R9  [RESC1005X40N]
R245  49R9  [RESC1005X40N]
R246  0  [RESC1005X40N]

### Ports
CON_N (bidir), CON_P (bidir), EN_RX (in), FMC_N (bidir), FMC_P (bidir)

### Nets
GND: C127.1 C128.1 C139.1 D12.1(GND) IC49.2(GND) IC49.4(GND) IC50.2(GND) IC50.4(GND) IC51.3(GND)
LVDS_REF: C139.2 R1.2
P3V3: C127.2 C128.2 D12.4(VCC) IC49.7(VCC) IC50.7(VCC) IC51.5(VCC)
CON_N: C141.1 R246.1 ; port CON_N
CON_P: C140.1 R243.1 ; port CON_P
EN_RX: IC49.3(EN) IC51.2(IN) ; port EN_RX
FMC_N: IC49.5(~{Q}) IC50.1(IN) ; port FMC_N
FMC_P: IC49.6(Q) IC50.8(IN) ; port FMC_P
NetC140_2: C140.2 D12.3(I/O2) IC49.8(IN) IC50.6(Q) R243.2 R245.2
NetC141_2: C141.2 D12.2(I/O1) IC49.1(IN) IC50.5(~{Q}) R244.2 R246.2
NetIC50_3: IC50.3(EN) IC51.4(OUT)
NetR1_1: R1.1 R244.1 R245.1

### Channels
U_fmc_digital_io_buffers1: designators end in A; ports CON_N=CON1_N1 CON_P=CON1_P1 EN_RX=EN1_RX1 FMC_N=FMC1_N1 FMC_P=FMC1_P1
U_fmc_digital_io_buffers2: designators end in B; ports CON_N=CON1_N2 CON_P=CON1_P2 EN_RX=EN1_RX2 FMC_N=FMC1_N2 FMC_P=FMC1_P2
U_fmc_digital_io_buffers3: designators end in C; ports CON_N=CON1_N3 CON_P=CON1_P3 EN_RX=EN1_RX3 FMC_N=FMC1_N3 FMC_P=FMC1_P3
U_fmc_digital_io_buffers4: designators end in D; ports CON_N=CON1_N4 CON_P=CON1_P4 EN_RX=EN1_RX4 FMC_N=FMC1_N4 FMC_P=FMC1_P4
U_fmc_digital_io_buffers5: designators end in E; ports CON_N=CON1_N5 CON_P=CON1_P5 EN_RX=EN1_RX5 FMC_N=FMC1_N5 FMC_P=FMC1_P5
U_fmc_digital_io_buffers6: designators end in F; ports CON_N=CON1_N6 CON_P=CON1_P6 EN_RX=EN1_RX6 FMC_N=FMC1_N6 FMC_P=FMC1_P6
U_fmc_digital_io_buffers7: designators end in G; ports CON_N=CON1_N7 CON_P=CON1_P7 EN_RX=EN1_RX7 FMC_N=FMC1_N7 FMC_P=FMC1_P7
U_fmc_digital_io_buffers8: designators end in H; ports CON_N=CON1_N8 CON_P=CON1_P8 EN_RX=EN1_RX8 FMC_N=FMC1_N8 FMC_P=FMC1_P8
U_fmc_digital_io_buffers9: designators end in I; ports CON_N=CON1_N9 CON_P=CON1_P9 EN_RX=EN1_RX9 FMC_N=FMC1_N9 FMC_P=FMC1_P9
U_fmc_digital_io_buffers10: designators end in J; ports CON_N=CON1_N10 CON_P=CON1_P10 EN_RX=EN1_RX10 FMC_N=FMC1_N10 FMC_P=FMC1_P10
U_fmc_digital_io_buffers11: designators end in K; ports CON_N=CON1_N11 CON_P=CON1_P11 EN_RX=EN1_RX11 FMC_N=FMC1_N11 FMC_P=FMC1_P11
U_fmc_digital_io_buffers12: designators end in L; ports CON_N=CON1_N12 CON_P=CON1_P12 EN_RX=EN1_RX12 FMC_N=FMC1_N12 FMC_P=FMC1_P12
U_fmc_digital_io_buffers13: designators end in M; ports CON_N=CON1_N13 CON_P=CON1_P13 EN_RX=EN1_RX13 FMC_N=FMC1_N13 FMC_P=FMC1_P13
U_fmc_digital_io_buffers14: designators end in N; ports CON_N=CON1_N14 CON_P=CON1_P14 EN_RX=EN1_RX14 FMC_N=FMC1_N14 FMC_P=FMC1_P14
U_fmc_digital_io_buffers15: designators end in O; ports CON_N=CON1_N15 CON_P=CON1_P15 EN_RX=EN1_RX15 FMC_N=FMC1_N15 FMC_P=FMC1_P15
U_fmc_digital_io_buffers16: designators end in P; ports CON_N=CON1_N16 CON_P=CON1_P16 EN_RX=EN1_RX16 FMC_N=FMC1_N16 FMC_P=FMC1_P16
U_fmc_digital_io_buffers17: designators end in Q; ports CON_N=CON1_N17 CON_P=CON1_P17 EN_RX=EN1_RX17 FMC_N=FMC1_N17 FMC_P=FMC1_P17
U_fmc_digital_io_buffers18: designators end in R; ports CON_N=CON1_N18 CON_P=CON1_P18 EN_RX=EN1_RX18 FMC_N=FMC1_N18 FMC_P=FMC1_P18
U_fmc_digital_io_buffers19: designators end in S; ports CON_N=CON1_N19 CON_P=CON1_P19 EN_RX=EN1_RX19 FMC_N=FMC1_N19 FMC_P=FMC1_P19
U_fmc_digital_io_buffers20: designators end in T; ports CON_N=CON1_N20 CON_P=CON1_P20 EN_RX=EN1_RX20 FMC_N=FMC1_N20 FMC_P=FMC1_P20
U_fmc_digital_io_buffers21: designators end in U; ports CON_N=CON1_N21 CON_P=CON1_P21 EN_RX=EN1_RX21 FMC_N=FMC1_N21 FMC_P=FMC1_P21
U_fmc_digital_io_buffers22: designators end in V; ports CON_N=CON1_N22 CON_P=CON1_P22 EN_RX=EN1_RX22 FMC_N=FMC1_N22 FMC_P=FMC1_P22
U_fmc_digital_io_buffers23: designators end in W; ports CON_N=CON1_N23 CON_P=CON1_P23 EN_RX=EN1_RX23 FMC_N=FMC1_N23 FMC_P=FMC1_P23
U_fmc_digital_io_buffers24: designators end in X; ports CON_N=CON1_N24 CON_P=CON1_P24 EN_RX=EN1_RX24 FMC_N=FMC1_N24 FMC_P=FMC1_P24
U_fmc_digital_io_buffers25: designators end in Y; ports CON_N=CON1_N25 CON_P=CON1_P25 EN_RX=EN1_RX25 FMC_N=FMC1_N25 FMC_P=FMC1_P25
U_fmc_digital_io_buffers26: designators end in Z; ports CON_N=CON1_N26 CON_P=CON1_P26 EN_RX=EN1_RX26 FMC_N=FMC1_N26 FMC_P=FMC1_P26
U_fmc_digital_io_buffers27: designators end in [; ports CON_N=CON1_N27 CON_P=CON1_P27 EN_RX=EN1_RX27 FMC_N=FMC1_N27 FMC_P=FMC1_P27
U_fmc_digital_io_buffers28: designators end in \; ports CON_N=CON1_N28 CON_P=CON1_P28 EN_RX=EN1_RX28 FMC_N=FMC1_N28 FMC_P=FMC1_P28
U_fmc_digital_io_buffers29: designators end in ]; ports CON_N=CON1_N29 CON_P=CON1_P29 EN_RX=EN1_RX29 FMC_N=FMC1_N29 FMC_P=FMC1_P29
U_fmc_digital_io_buffers30: designators end in ^; ports CON_N=CON1_N30 CON_P=CON1_P30 EN_RX=EN1_RX30 FMC_N=FMC1_N30 FMC_P=FMC1_P30
U_fmc_digital_io_buffers31: designators end in _; ports CON_N=CON1_N31 CON_P=CON1_P31 EN_RX=EN1_RX31 FMC_N=FMC1_N31 FMC_P=FMC1_P31
U_fmc_digital_io_buffers32: designators end in `; ports CON_N=CON1_N32 CON_P=CON1_P32 EN_RX=EN1_RX32 FMC_N=FMC1_N32 FMC_P=FMC1_P32

### Notes on the sheet
- Project/Equipment
- Document
- Designer
- Drawn by
- Check.by
- Copyright Creotech Instruments SA 2014.
  This documentation describes Open Hardware and is licensed under the CERN OHL v.1.1. You may redistribute and modify this documentation under the terms of the CERN OHL v.1.1. (http://ohwr.org/CERNOHL). This documentation is distributed WITHOUT ANY EXPRESS OR IMPLIED WARRANTY, INCLUDING OF MERCHANTABILITY, SATISFACTORY QUALITY AND FITNESS FOR A PARTICULAR PURPOSE. Please see the CERN OHL v.1.1 for applicable conditions.
- File
- Last Mod.
- Print Date
- Sheet
- Size
- A3
- of
- Rev
- (in symbol R0402_49R9_1%_0.0625W_100PPM) 1%

### Library data of the parts
C127 C128 C139-C141 = CC0402_100NF_16V_10%_X5R: as C146 on sheet FMC_DIO_32ch_lvds_a; Part Number: CC0402_100NF_16V_10%_X5R; Component Kind: Standard; Component Type: Standard; Pin Count: 2; Value: 100nF; Status: None; Manufacturer Part Number: CC0402_100NF_16V_10%_X5R; Case: 0402; Mounted: Yes; Socket: No; SMD: Yes; Manufacturer1 Example: MURATA; Manufacturer1 ComponentHeight: 0.55mm; HelpURL: \\cern.ch\dfs\Applications\Altium\Datasheets\CC0402_X5R_MURATA_GRM.pdf; Author: CERN DEM JLC; CreateDate: 2013-12-10; LatestRevisionDate: 2013-12-10
D12 = PRTR5V0U2X: Ultra Low Capacitance Double Rail-to-Rail ESD Protection Diode; Part Description: Ultra Low Capacitance (1pF) Double Rail-to-Rail ESD Protection Diode (8kV); Manufacturer: NXP SEMICONDUCTORS; Voltage: 5.5V; PressFit: No; Bonding: No; Table: Diodes; Part Number: PRTR5V0U2X; Component Kind: Standard; Component Type: Standard; Device: PRTR5V0U2X; PackageDescription: SOT143B, SOT, 1.90mm Pitch; 4 Pin, 1.30mm W X 2.90mm L X 1.10mm H body, IPC Medium Density; Manufacturer Part Number: PRTR5V0U2X; Pin Count: 4; Case: SOT143B; Mounted: Yes; Socket: No; SMD: Yes; ComponentHeight: 1.1mm; HelpURL: \\cern.ch\dfs\Applications\Altium\Datasheets\PRTR5V0U2X.pdf; Author: CERN DEM JLC; CreateDate: 2011-03-22; LatestRevisionDate: 2011-03-22
IC49 IC50 = IFC_FIN1101K8X: LVDS TO LVDS repeater3.3V
IC51 = 74AHC1G04GW: Single Inverter Buffer; Manufacturer: NXP SEMICONDUCTORS; PressFit: No; Bonding: No; Table: Standard Logic; Part Number: 74AHC1G04GW; Component Kind: Standard; Component Type: Standard; Device: 74AHC1G04GW; PackageDescription: SOT353, SOT, 0.65mm Pitch, 5 pin, 1.25mm W X 2.05mm L X 1.10mm H, IPC Medium Density; Part Description: Single Inverter Buffer; Manufacturer Part Number: 74AHC1G04GW; Pin Count: 3; Case: SOT353; Mounted: Yes; Socket: No; SMD: Yes; ComponentHeight: 1.1mm; Author: CERN DEM JLC; HelpURL: \\cern.ch\dfs\Applications\Altium\Datasheets\74AHC1G04GW.pdf; CreateDate: 2010-03-03; LatestRevisionDate: 2010-03-03
R1 R243 R246 = R0402_0R_JUMPER: as R265 on sheet FMC_DIO_32ch_lvds_a; Part Number: R0402_0R_JUMPER; Component Kind: Standard; Component Type: Standard; Pin Count: 2; Value: 0; Status: Not recommended; Manufacturer Part Number: R0402_0R_JUMPER; Case: 0402; Mounted: Yes; Socket: No; SMD: Yes; Manufacturer1 Example: YAGEO PHYCOMP; Manufacturer1 ComponentHeight: 0.4mm; HelpURL: \\cern.ch\dfs\Applications\Altium\Datasheets\R0402_Phycomp_RC0402.pdf; Author: CERN DEM JLC; CreateDate: 2007-12-03; LatestRevisionDate: 2012-10-17
R244 R245 = R0402_49R9_1%_0.0625W_100PPM: Resistor - 1%; Part Description: General Purpose Thick Film Chip Resistor; Manufacturer: GENERIC; Manufacturer1 Part Number: 232270674999L or RC0402FR-0749R9L; TC: ±100ppm/°C; Table: Resistors SMD; Part Number: R0402_49R9_1%_0.0625W_100PPM; Component Kind: Standard; Component Type: Standard; Pin Count: 2; Value: 49R9; Status: Not recommended; Power: 0.0625W; Tolerance: ±1%; Manufacturer Part Number: R0402_49R9_1%_0.0625W_100PPM; Case: 0402; Mounted: Yes; Socket: No; SMD: Yes; Manufacturer1 Example: YAGEO PHYCOMP; Manufacturer1 ComponentHeight: 0.4mm; HelpURL: \\cern.ch\dfs\Applications\Altium\Datasheets\R0402_Phycomp_RC0402.pdf; Author: CERN DEM JLC; CreateDate: 2012-10-24; LatestRevisionDate: 2012-10-24